# Altium schematic sheet GND_PCB_Data_Conversion.SchDoc
size A
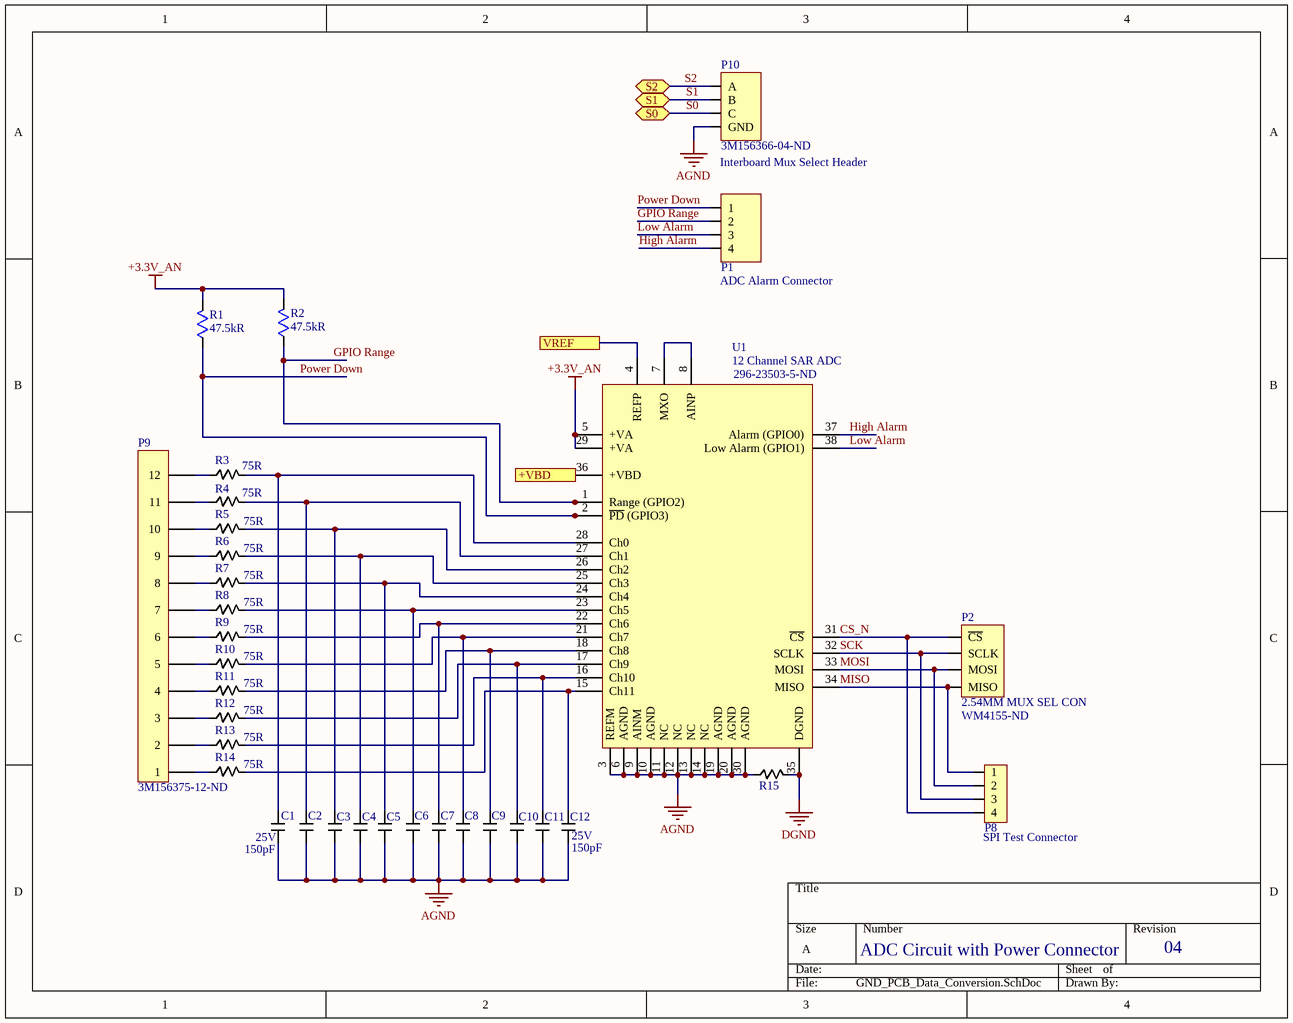
[diagram p0: GND_PCB_Data_Conversion.SchDoc]

## Parts
C1  Capacitance: 150pF  Voltage Rating: 25V  [150PF Cap Charge Resevoir]  (hidden comment: 150PF Charge Res Caps)
C2  150PF Charge Res Caps  [150PF Cap Charge Resevoir]  (value not drawn)
C3  150PF Charge Res Caps  [150PF Cap Charge Resevoir]  (value not drawn)
C4  150PF Charge Res Caps  [150PF Cap Charge Resevoir]  (value not drawn)
C5  150PF Charge Res Caps  [150PF Cap Charge Resevoir]  (value not drawn)
C6  150PF Charge Res Caps  [150PF Cap Charge Resevoir]  (value not drawn)
C7  150PF Charge Res Caps  [150PF Cap Charge Resevoir]  (value not drawn)
C8  150PF Charge Res Caps  [150PF Cap Charge Resevoir]  (value not drawn)
C9  150PF Charge Res Caps  [150PF Cap Charge Resevoir]  (value not drawn)
C10  150PF Charge Res Caps  [150PF Cap Charge Resevoir]  (value not drawn)
C11  150PF Charge Res Caps  [150PF Cap Charge Resevoir]  (value not drawn)
C12  Capacitance: 150pF  Voltage Rating: 25V  [150PF Cap Charge Resevoir]  (hidden comment: 150PF Charge Res Caps)
P1  4 pos ADC Alarm Header  [4POS 2.54MM HEADER MUX SEL]  (value not drawn)
P2  2.54MM MUX SEL CON  Supplier Part Number 1: WM4155-ND  [4POS 2.54MM HEADER MUX SEL]
P8  4POS SPI Test Connector Header Pin  [4POS SPI Test Connector]  (value not drawn)
P9  Supplier Part Number 1: 3M156375-12-ND  [12POS Dual Header W/0 3D Body]  (hidden comment: 12POS Dual Header W/O 3D Body)
P10  Supplier Part Number 1: 3M156366-04-ND  [Mux Select Interboard Connector]  (hidden comment: Mux Select Interboard Header)
R1  Resistance: 47.5kR  [Green_LED_Resistor_90.9]  (hidden comment: Green)
R2  Resistance: 47.5kR  [0603_MD_RES]  (hidden comment: 47.5k PullUp RES ADC)
R3  Resistance: 75R  [Chip2PinSM127P600-8N]  (hidden comment: 75 Ohm Charge Resevoir Resistor)
R4  Resistance: 75R  [Chip2PinSM127P600-8N]  (hidden comment: 75 Ohm Charge Resevoir Resistor)
R5  Resistance: 75R  [Chip2PinSM127P600-8N]  (hidden comment: 75 Ohm Charge Resevoir Resistor)
R6  Resistance: 75R  [Chip2PinSM127P600-8N]  (hidden comment: 75 Ohm Charge Resevoir Resistor)
R7  Resistance: 75R  [Chip2PinSM127P600-8N]  (hidden comment: 75 Ohm Charge Resevoir Resistor)
R8  Resistance: 75R  [Chip2PinSM127P600-8N]  (hidden comment: 75 Ohm Charge Resevoir Resistor)
R9  Resistance: 75R  [Chip2PinSM127P600-8N]  (hidden comment: 75 Ohm Charge Resevoir Resistor)
R10  Resistance: 75R  [Chip2PinSM127P600-8N]  (hidden comment: 75 Ohm Charge Resevoir Resistor)
R11  Resistance: 75R  [Chip2PinSM127P600-8N]  (hidden comment: 75 Ohm Charge Resevoir Resistor)
R12  Resistance: 75R  [Chip2PinSM127P600-8N]  (hidden comment: 75 Ohm Charge Resevoir Resistor)
R13  Resistance: 75R  [Chip2PinSM127P600-8N]  (hidden comment: 75 Ohm Charge Resevoir Resistor)
R14  Resistance: 75R  [Chip2PinSM127P600-8N]  (hidden comment: 75 Ohm Charge Resevoir Resistor)
R15  0 Ohm Resistor  [0 Ohm Resistor]  (value not drawn)
U1  12 Channel SAR ADC  Supplier Part Number 1: 296-23503-5-ND  [12 Channel SAR ADC]

## Ports
+VBD, S0 (bidir), S1 (bidir), S2 (bidir), VREF

## Nets
+3.3V_AN: R1.2 R2.2 U1.5(+VA) U1.29(+VA)
AGND: C1.1 C2.1 C3.1 C4.1 C5.1 C6.1 C7.1 C8.1 C9.1 C10.1 C11.1 C12.1 P10.4(GND) R15.1 U1.3(REFM) U1.6(AGND) U1.9(AINM) U1.10(AGND) U1.11(NC) U1.12(NC) U1.13(NC) U1.14(NC) U1.19(AGND) U1.20(AGND) U1.30(AGND)
DGND: R15.2 U1.35(DGND)
+VBD: U1.36(+VBD) ; port +VBD
CS_N: P2.4(~{CS}) P8.4 U1.31(~{CS})
GPIO Range: P1.2 R2.1 U1.1(Range_(GPIO2))
High Alarm: P1.4 U1.37(Alarm_(GPIO0))
Low Alarm: P1.3 U1.38(Low_Alarm_(GPIO1))
MISO: P2.1(MISO) P8.1 U1.34(MISO)
MOSI: P2.2(MOSI) P8.2 U1.33(MOSI)
Power Down: P1.1 R1.1 U1.2(~{PD}_(GPIO3))
S0: P10.3(C) ; port S0
S1: P10.2(B) ; port S1
S2: P10.1(A) ; port S2
SCK: P2.3(SCLK) P8.3 U1.32(SCLK)
VREF: U1.4(REFP) ; port VREF
NetC1_2: C1.2 R3.2 U1.28(Ch0)
NetC2_2: C2.2 R4.2 U1.27(Ch1)
NetC3_2: C3.2 R5.2 U1.26(Ch2)
NetC4_2: C4.2 R6.2 U1.25(Ch3)
NetC5_2: C5.2 R7.2 U1.24(Ch4)
NetC6_2: C6.2 R8.2 U1.23(Ch5)
NetC7_2: C7.2 R9.2 U1.22(Ch6)
NetC8_2: C8.2 R10.2 U1.21(Ch7)
NetC9_2: C9.2 R11.2 U1.18(Ch8)
NetC10_2: C10.2 R12.2 U1.17(Ch9)
NetC11_2: C11.2 R13.2 U1.16(Ch10)
NetC12_2: C12.2 R14.2 U1.15(Ch11)
NetP9_1: P9.1 R14.1
NetP9_2: P9.2 R13.1
NetP9_3: P9.3 R12.1
NetP9_4: P9.4 R11.1
NetP9_5: P9.5 R10.1
NetP9_6: P9.6 R9.1
NetP9_7: P9.7 R8.1
NetP9_8: P9.8 R7.1
NetP9_9: P9.9 R6.1
NetP9_10: P9.10 R5.1
NetP9_11: P9.11 R4.1
NetP9_12: P9.12 R3.1
NetU1_7: U1.7(MXO) U1.8(AINP)

## Notes on the sheet
- Interboard Mux Select Header
- (near P1) ADC Alarm Connector
- (near P8) SPI Test Connector
- ADC Circuit with Power Connector
- 04

## Library data of the parts
C1-C12 = 150PF Charge Res Caps: Charge Res Caps for ADC input channels; Manufacturer: KEMET; Manufacturer Part Number: C0402C151J3GAC7867; Tolerance: 5%; Supplier 1: Digi-Key; Stock 1: 18237; Pricing 1: 1=0.10000, 10=0.04300, 100=0.01920, 500=0.01374, 1000=0.01080, 2500=0.00982, 5000=0.00903 (USD); Mount: Surface Mount; Case/Package: 0402; Min Operating Temperature: -55°C; Max Operating Temperature: 125°C; Packaging: Cut Tape; ComponentLink1URL: http://components.arrow.com/part/dataview/46126249S9911696N7429?src-supplier=Arrow; ComponentLink1Description: http://components.arrow.com/part/dataview/46126249S9911696N7429?src-supplier=Arrow; ComponentLink2URL: http://www.kemet.com/docfinder?Partnumber=C0402C151J3GACTU&src-supplier=Digi-Key; ComponentLink2Description: http://www.kemet.com/docfinder?Partnumber=C0402C151J3GACTU&src-supplier=Digi-Key; Supplier Part Number 1: 399-14422-1-ND; Case Code (Imperial): 0402; Case Code (Metric): 1005; ComponentLink3URL: https://api.kemet.com/component-edge/download/datasheet/C0402C151J3GACTU.pdf?src-supplier=Digi-Key; ComponentLink3Description: https://api.kemet.com/component-edge/download/datasheet/C0402C151J3GACTU.pdf?src-supplier=Digi-Key; ComponentLink4URL: http://datasheet.octopart.com/C0402C151J3GAC7867-KEMET-datasheet-84169754.pdf; ComponentLink4Description: http://datasheet.octopart.com/C0402C151J3GAC7867-KEMET-datasheet-84169754.pdf
P1 = 4 pos ADC Alarm Header: Connector Header Through Hole, Right Angle 4 position 0.100" (2.54mm); Manufacturer: Molex; Manufacturer Part Number: 0705530108; Contact Resistance: 30mR; Number of Positions: 4; Connector Type: Male Pin; Pitch: 0.1inch; Supplier 1: Digi-Key; Stock 1: 858; Pricing 1: 1=2.03000, 10=1.83800, 100=1.57500, 500=1.31250, 1000=1.12500, 5000=0.99750, 10000=0.97500 (USD); RoHS: Yes; Mount: Through Hole; Contact Plating: Gold; Contact Material: Bronze; Housing Material: Polyester; Color: Black; Housing Color: Black; Min Operating Temperature: -40°C; Max Operating Temperature: 105°C; Number of Rows: 1; Packaging: Rail/Tube; Termination: Solder; Orientation: Right Angle; Fastening Type: Latch; Length: 12.71mm; Contact Mating Length: 0.24inch; Depth: 13.59mm; Radiation Hardening: No; ComponentLink1URL: https://datasheet.ciiva.com/6829/705530106-sd-6829901.pdf?src-supplier=Digi-Key; ComponentLink1Description: https://datasheet.ciiva.com/6829/705530106-sd-6829901.pdf?src-supplier=Digi-Key; ComponentLink2URL: https://datasheet.ciiva.com/16498/0705530108-pcb-headers-16498173.pdf?src-supplier=Avnet+Asia; ComponentLink2Description: https://datasheet.ciiva.com/16498/0705530108-pcb-headers-16498173.pdf?src-supplier=Avnet+Asia; Supplier Part Number 1: WM4155-ND
P2 = 2.54MM MUX SEL CON: SPI Connector; Manufacturer: Molex; Manufacturer Part Number: 0705530108; Contact Resistance: 30mR; Number of Positions: 4; Connector Type: Male Pin; Pitch: 0.1inch; Voltage Rating: 250V; Current Rating: 3A; Gender: Male; Insulation Resistance: 1GR; Glow Wire Compliant: Non-compliant; Supplier 1: Digi-Key; Stock 1: 1281; Mount: Through Hole; Contact Plating: Gold; Contact Material: Bronze; Housing Material: Polyester; Color: Black; Housing Color: Black; Min Operating Temperature: -40°C; Max Operating Temperature: 105°C; Number of Rows: 1; Packaging: Rail/Tube; Termination: Solder; Orientation: Right Angle; Fastening Type: Latch; Length: 12.71mm; Contact Mating Length: 0.24inch; Depth: 13.59mm; Radiation Hardening: No; ComponentLink1URL: https://www.molex.com/pdm_docs/ps/PS-70400.pdf?src-supplier=Digi-Key; ComponentLink1Description: https://www.molex.com/pdm_docs/ps/PS-70400.pdf?src-supplier=Digi-Key; ComponentLink2URL: http://www.molex.com/webdocs/datasheets/pdf/en-us/0705530108_PCB_HEADERS.pdf?src-supplier=Avnet+Asia; ComponentLink2Description: http://www.molex.com/webdocs/datasheets/pdf/en-us/0705530108_PCB_HEADERS.pdf?src-supplier=Avnet+Asia; Pricing 1: 1=2.03, 10=1.838, 100=1.575, 500=1.3125, 1680=1.0875, 5040=0.9975, 10080=0.975 (USD); Material: Brass; Package Quantity: 1680; Number of Contacts: 4; Voltage Rating (DC): 250V; Number of Circuits: 4; REACH SVHC: Unknown; ELV: Compliant; Flammability Rating: UL94 V-0; ComponentLink3URL: http://www.farnell.com/datasheets/2027073.pdf?src-supplier=Element14; ComponentLink3Description: http://www.farnell.com/datasheets/2027073.pdf?src-supplier=Element14; ComponentLink4URL: http://www.molex.com/webdocs/datasheets/pdf/en-us/0705530108_PCB_HEADERS.pdf?src-supplier=Avnet; ComponentLink4Description: http://www.molex.com/webdocs/datasheets/pdf/en-us/0705530108_PCB_HEADERS.pdf?src-supplier=Avnet; ComponentLink5URL: http://www.mouser.com/ds/2/276/0705530108_PCB_HEADERS-172949.pdf?src-supplier=Mouser; ComponentLink5Description: http://www.mouser.com/ds/2/276/0705530108_PCB_HEADERS-172949.pdf?src-supplier=Mouser
P8 = 4POS SPI Test Connector Header Pin: Connector Header Through Hole, Right Angle 4 position 0.100" (2.54mm); Manufacturer: TE Connectivity; Manufacturer Part Number: 640455-4; Underplate Material: Nickel; Contact Resistance: 6mR; Current Rating: 5A; Voltage Rating: 250V; Number of Positions: 4; Connector Type: Plug,Header,Pin; Backwall/Post Interruptions: No (Without); Connector System: Wire-to-Board; Plating Thickness: 3.81um; PCB Mount Retention: Without; Contact Post Length: 3.56mm; PCB Thickness: 0.063inch; Approvals: CSA; Supplier 1: Digi-Key; Stock 1: 4333; Pricing 1: 1=0.14000, 10=0.12700, 100=0.08780, 500=0.07430, 1000=0.06080, 5000=0.05404, 10000=0.05066 (USD); RoHS: Yes; Mount: Through Hole; Contact Material: Copper Alloy; Contact Plating: Tin; Color: Natural,Beige; Housing Color: Natural; Housing Material: Polyester; Contact Shape: Square; Min Operating Temperature: -67°C; Max Operating Temperature: 221°C; Number of Rows: 1; Packaging: Bulk; Package Quantity: 1; Contact Gender: Male; Max Voltage Rating (AC): 250V; Termination: Solder; Number of Contacts: 4; Orientation: Right Angle; Voltage Rating (AC): 250V; Contact Retention: No (Without); Mating Alignment: No (Without); Mating Retention: No (Without); PCB Mount Alignment: No (Without); PCB Mounting Orientation: Right Angle; Sealable: No (Without); Strain Relief: No (Without); Shrouded: No (Without); Contact Current Rating: 5A; Length: 0.4inch; Height: 7.75mm; Pitch: 2.54mm; Contact Mating Length: 0.295inch; Depth: 11.05mm; Tail Length: 3.56mm; Radiation Hardening: No; REACH SVHC: Unknown; Flammability Rating: UL94 V-0; ELV: Compliant; Lead Free: Lead Free; ComponentLink1URL: https://datasheet.ciiva.com/16499/eng-ds-82056-mta-0608-16499288.pdf?src-supplier=Future+Electronics; ComponentLink1Description: https://datasheet.ciiva.com/16499/eng-ds-82056-mta-0608-16499288.pdf?src-supplier=Future+Electronics; ComponentLink2URL: https://datasheet.ciiva.com/11752/0900766b81020fb4-11752965.pdf?src-supplier=RSComponents; ComponentLink2Description: https://datasheet.ciiva.com/11752/0900766b81020fb4-11752965.pdf?src-supplier=RSComponents; ComponentLink3URL: https://datasheet.ciiva.com/30226/8852eng-ds-82056-mta-0608-30226713.pdf?src-supplier=Onlinecomponents.com; ComponentLink3Description: https://datasheet.ciiva.com/30226/8852eng-ds-82056-mta-0608-30226713.pdf?src-supplier=Onlinecomponents.com; ComponentLink4URL: https://datasheet.ciiva.com/709/eng-cd-640455-y2-709686.pdf?src-supplier=Digi-Key; ComponentLink4Description: https://datasheet.ciiva.com/709/eng-cd-640455-y2-709686.pdf?src-supplier=Digi-Key; Supplier Part Number 1: A19452-ND
P9 = 12POS Dual Header W/O 3D Body: Connector Header Through Hole 12 position 0.100" (2.54mm); Manufacturer: 3M; Manufacturer Part Number: 929715-06-06-EU; Number of Positions: 12; Gender: Male; Connector Type: Male Pin; Pitch: 0.1inch; Supplier 1: Digi-Key; Stock 1: 0; Pricing 1: 1=1.86000, 10=1.69000, 25=1.58600, 50=1.51720, 100=1.44820, 250=1.31024, 500=1.20680 (USD); RoHS: Yes; Mount: Through Hole; Color: Black; Contact Plating: Gold; Package Quantity: 500; Number of Rows: 2; Packaging: Bulk; Termination: Solder; Row Spacing: 0.1inch; Contact Mating Length: 0.318inch; ComponentLink1URL: http://components.arrow.com/part/dataview/42715320S8912076N3321?src-supplier=Arrow; ComponentLink1Description: http://components.arrow.com/part/dataview/42715320S8912076N3321?src-supplier=Arrow; ComponentLink2URL: http://www.mouser.com/ds/2/1/ts0769-35914.pdf?src-supplier=Mouser; ComponentLink2Description: http://www.mouser.com/ds/2/1/ts0769-35914.pdf?src-supplier=Mouser; ComponentLink3URL: http://multimedia.3m.com/mws/mediawebserver?66666UuZjcFSLXTtmXME5x46EVuQEcuZgVs6EVs6E666666--?src-supplier=Digi-Key; ComponentLink3Description: http://multimedia.3m.com/mws/mediawebserver?66666UuZjcFSLXTtmXME5x46EVuQEcuZgVs6EVs6E666666--?src-supplier=Digi-Key
P10 = Mux Select Interboard Header: Connector Header Through Hole 4 position 0.100" (2.54mm); Manufacturer: 3M; Manufacturer Part Number: 929710-06-02-RK; Number of Positions: 4; Gender: Male; Connector Type: Male Pin; Pitch: 0.1inch; Supplier 1: Digi-Key; Stock 1: 0; Pricing 1: 1=0.55000, 10=0.52000, 25=0.46800, 50=0.41600, 100=0.39870, 250=0.36400, 500=0.34666 (USD); Mount: Through Hole; Color: Black; Contact Plating: Tin; Package Quantity: 1000; Number of Rows: 2; Packaging: Bulk; Termination: Solder; Row Spacing: 0.1inch; Contact Mating Length: 0.318inch; ComponentLink1URL: https://datasheet.ciiva.com/6818/ts0769-6818121.pdf?src-supplier=Digi-Key; ComponentLink1Description: https://datasheet.ciiva.com/6818/ts0769-6818121.pdf?src-supplier=Digi-Key; ComponentLink2URL: https://datasheet.ciiva.com/15402/ts0769-15402221.pdf?src-supplier=Mouser; ComponentLink2Description: https://datasheet.ciiva.com/15402/ts0769-15402221.pdf?src-supplier=Mouser
R1 R2 = 47.5k PullUp RES ADC: RES 47.5K OHM 0.5% 1/10W 0603; Manufacturer: Stackpole Electronics; Manufacturer Part Number: RNCF0603DTE47K5; Power Rating: 63mW; Mount: Surface Mount; Case/Package: 0603; Min Operating Temperature: -55°C; Max Operating Temperature: 155°C; Tolerance: 0.5%; Packaging: Tape and Reel; ComponentLink1URL: http://datasheet.octopart.com/RNCF0603DTE47K5-Stackpole-Electronics-datasheet-10788241.pdf?src-supplier=Stackpole+Electronics; ComponentLink1Description: http://datasheet.octopart.com/RNCF0603DTE47K5-Stackpole-Electronics-datasheet-10788241.pdf?src-supplier=Stackpole+Electronics; ComponentLink2URL: http://datasheet.octopart.com/RNCF0603DTE47K5-Stackpole-Electronics-datasheet-12511394.pdf?src-supplier=Stackpole+Electronics; ComponentLink2Description: http://datasheet.octopart.com/RNCF0603DTE47K5-Stackpole-Electronics-datasheet-12511394.pdf?src-supplier=Stackpole+Electronics; ComponentLink3URL: http://datasheet.octopart.com/RNCF0603DTE47K5-Stackpole-Electronics-datasheet-11755897.pdf; ComponentLink3Description: http://datasheet.octopart.com/RNCF0603DTE47K5-Stackpole-Electronics-datasheet-11755897.pdf; Supplier 1: Digi-Key; Stock 1: 5000; Pricing 1: 1=0.15000, 10=0.12700, 100=0.04970, 1000=0.02079, 2500=0.01906 (USD); Supplier Part Number 1: RNCF0603DTE47K5CT-ND
R3-R14 = 75 Ohm Charge Resevoir Resistor: Manufacturer: Rohm; Manufacturer Part Number: KTR03EZPF75R0; Tolerance: 1%; Max Power Dissipation: 100mW; Temperature Coefficient: 100ppm/°C; Supplier 1: Digi-Key; Stock 1: 9052; Pricing 1: 1=0.15000, 10=0.13500, 100=0.05200, 1000=0.02287, 2500=0.01975 (USD); RoHS: Yes; Case/Package: 0603; Case Code (Metric): 1608; Case Code (Imperial): 0603; Min Operating Temperature: -55°C; Max Operating Temperature: 155°C; Package Quantity: 1; Packaging: Cut Tape; Composition: Thick Film; Number of Terminations: 2; Features: Automotive AEC-Q200; Length: 0.063inch; Height: 0.022inch; Width: 0.031inch; ComponentLink1URL: https://datasheet.ciiva.com/14930/ktr-14930245.pdf?src-supplier=Digi-Key; ComponentLink1Description: https://datasheet.ciiva.com/14930/ktr-14930245.pdf?src-supplier=Digi-Key; ComponentLink2URL: https://datasheet.ciiva.com/14924/ktr-14924923.pdf?src-supplier=Digi-Key; ComponentLink2Description: https://datasheet.ciiva.com/14924/ktr-14924923.pdf?src-supplier=Digi-Key; ComponentLink3URL: https://datasheet.ciiva.com/14928/ktr-14928475.pdf?src-supplier=Digi-Key; ComponentLink3Description: https://datasheet.ciiva.com/14928/ktr-14928475.pdf?src-supplier=Digi-Key; Supplier Part Number 1: RHM75AYCT-ND
R15 = 0 Ohm Resistor: 0 Ohm Resistor for connecting polygon pours
U1 = 12 Channel SAR ADC: 12 Bit SAR ADC; Manufacturer: Texas Instruments; Manufacturer Part Number: ADS7952SDBT; Min Supply Voltage: 2.7V; Max Supply Voltage: 5.25V; Interface: SPI; Number of Channels: 12; Sampling Rate: 1MS/s; Number of Converters: 1; Resolution: 12b; Polarity: Unipolar; Supply Type: Analog; Integral Nonlinearity (INL): 1.5LSB; Signal to Noise Ratio (SNR): 71.7dB; Power Consumption: 11.5mW; Operating Supply Voltage: 3.3V; Full Scale Error: 2LSB; Power Dissipation: 14.5mW; Nominal Supply Current: 2.3mA; Supplier 1: Digi-Key; Stock 1: 1697; Pricing 1: 1=9.30000, 10=8.40000, 50=8.00940, 100=6.95450, 500=6.05586, 1000=5.27445 (USD); RoHS: Yes; Mount: Surface Mount; Case/Package: TSSOP; Number of Pins: 38; Contact Plating: Gold; Min Operating Temperature: -40°C; Max Operating Temperature: 125°C; Packaging: Rail/Tube; Package Quantity: 50; Number of Bits: 12; Number of Elements: 1; Number of A/D Converters: 1; Number of Analog Inputs: 12; Conversion Rate: 1MS/s; Number of Inputs: 12; Radiation Hardening: No; Lead Free: Lead Free; REACH SVHC: No SVHC; ComponentLink1URL: https://datasheet.ciiva.com/41460/001186285-da-01-en-ic-adc-12bit-1m-ads7952sdbt-tssop-38-tid-41460243.pdf?src-supplier=Conrad; ComponentLink1Description: https://datasheet.ciiva.com/41460/001186285-da-01-en-ic-adc-12bit-1m-ads7952sdbt-tssop-38-tid-41460243.pdf?src-supplier=Conrad; ComponentLink2URL: https://datasheet.ciiva.com/14258/ads7961-14258981.pdf?src-supplier=Avnet; ComponentLink2Description: https://datasheet.ciiva.com/14258/ads7961-14258981.pdf?src-supplier=Avnet; ComponentLink3URL: https://datasheet.ciiva.com/1263/ads7950-1263926.pdf?src-supplier=Digi-Key; ComponentLink3Description: https://datasheet.ciiva.com/1263/ads7950-1263926.pdf?src-supplier=Digi-Key